# Altium schematic sheet Klon.SchDoc: BLACK - KC 1.0
size A3; Organization: Andrés Nomberto; Address1: facebook.com/; Address2: andres.nomberto; DocumentNumber: 1; Revision: 1.0; SheetNumber: 1; SheetTotal: 1; RepoGIT: https://github.com/AndresNomberto/KlonCentaur
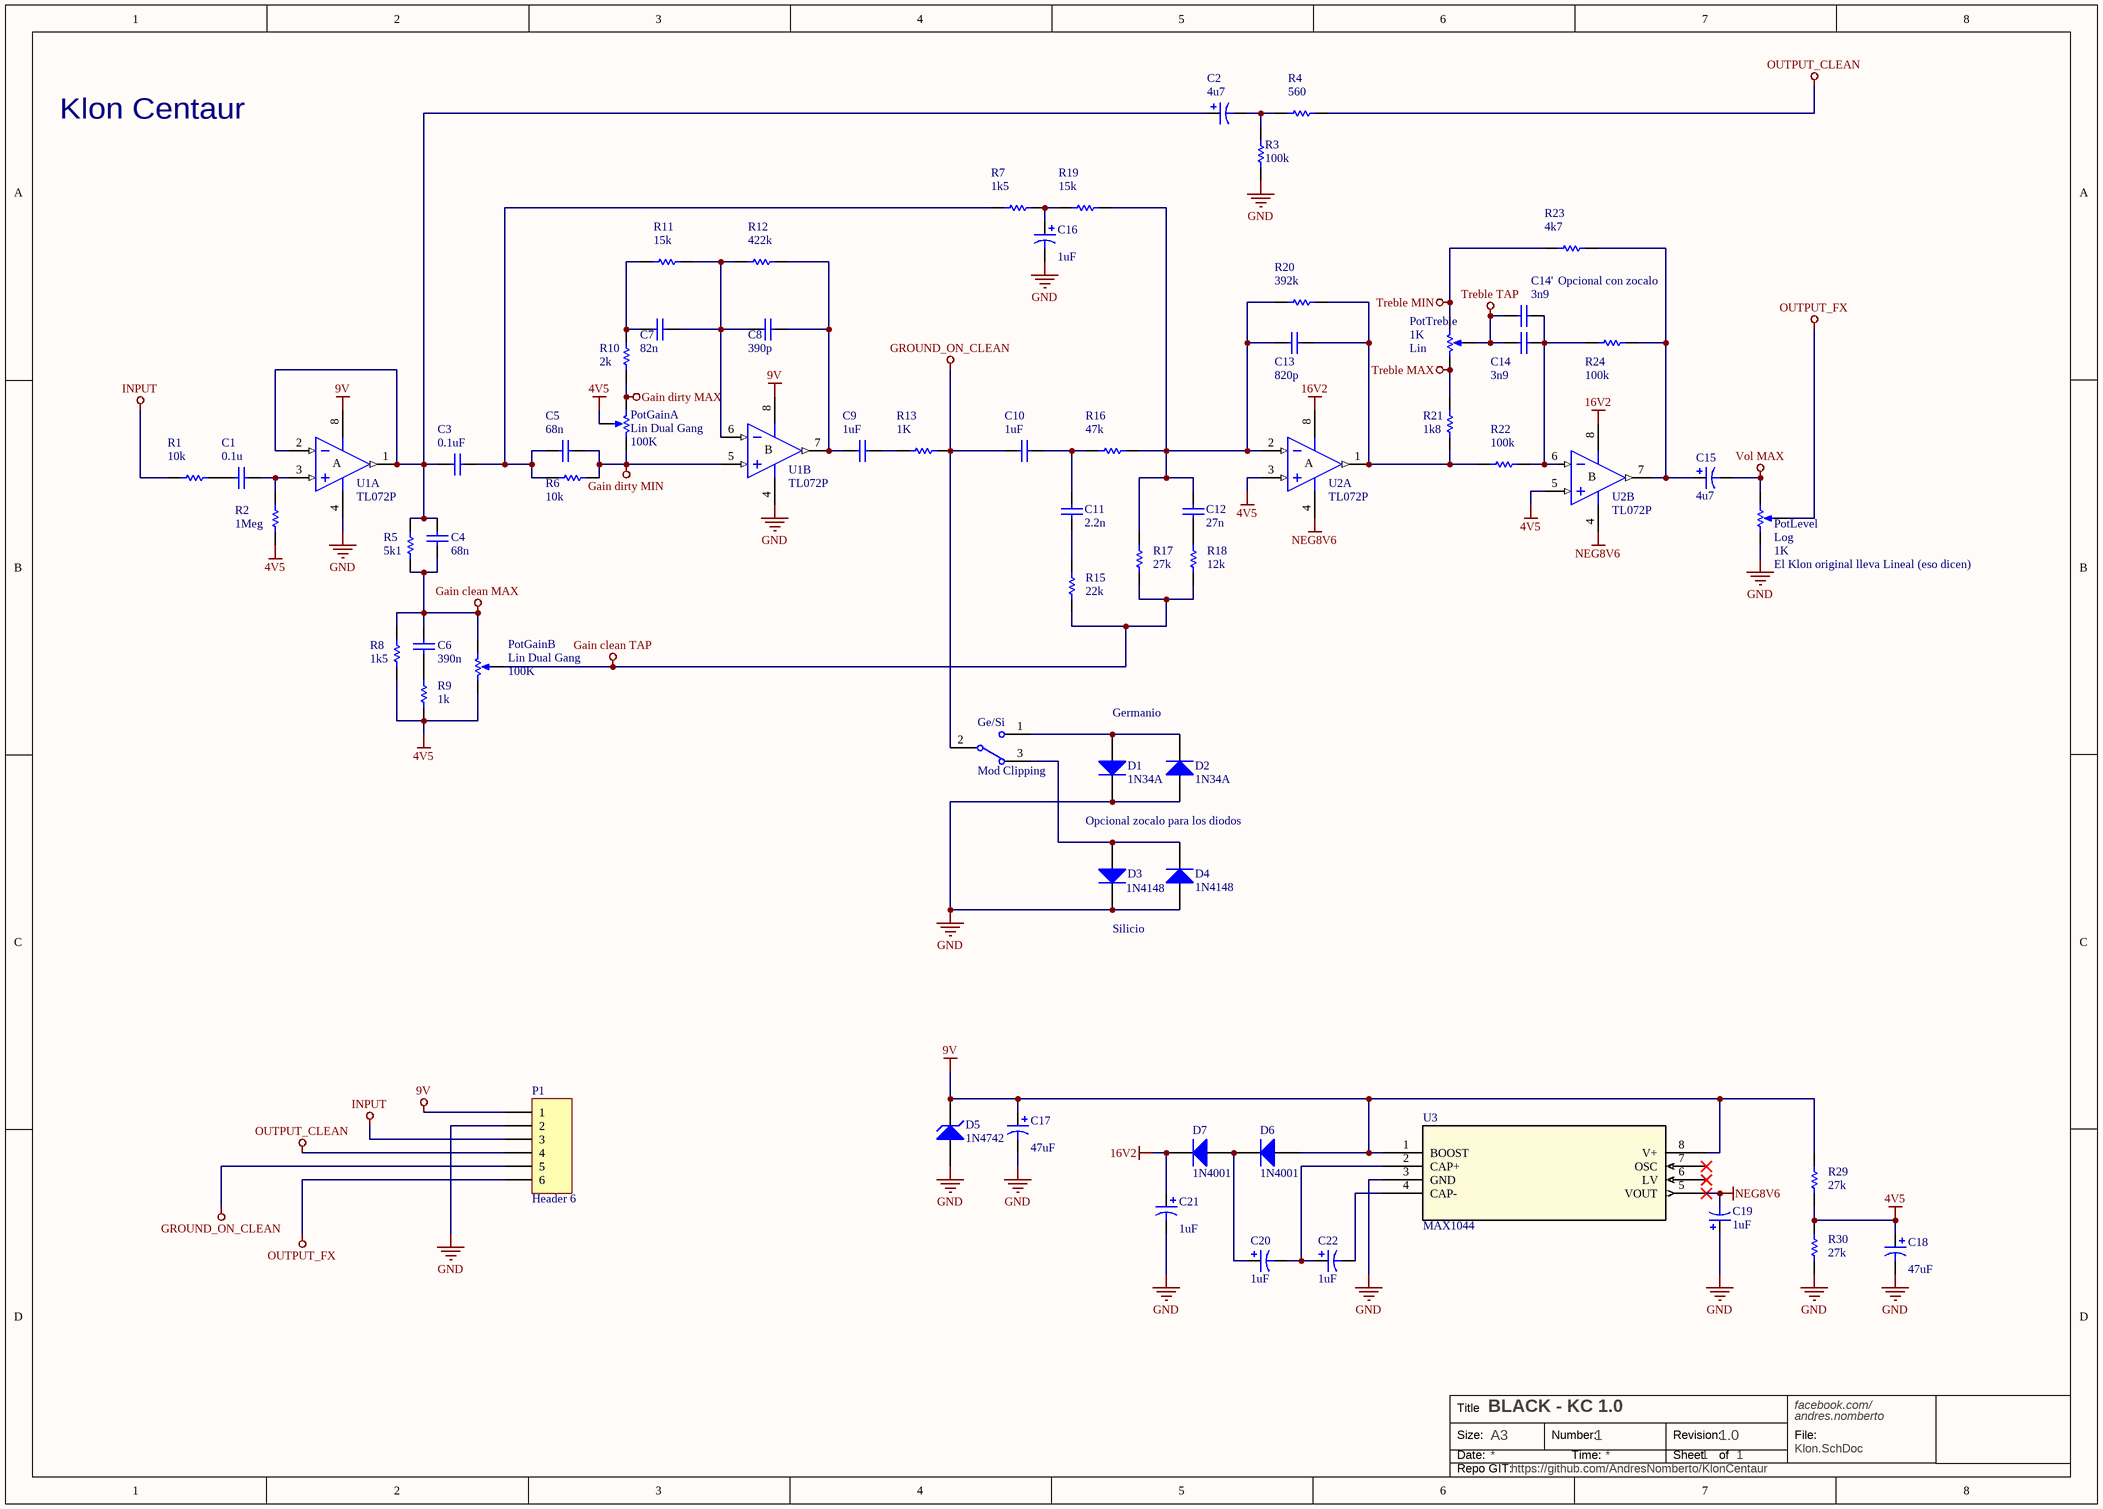
[diagram p0: Klon.SchDoc]

## Parts
C1  value 0.1u  [Cap Box 0.2]  (hidden comment: Cap)
C2  value 4u7  [Cap Pol 80mil]  (hidden comment: Cap Pol1)
C3  value 0.1uF  [Cap Box 0.2]  (hidden comment: Cap)
C4  value 68n  [Cap Box 0.2]  (hidden comment: Cap)
C5  value 68n  [Cap Box 0.2]  (hidden comment: Cap)
C6  value 390n  [Cap Polyester 200mil]  (hidden comment: Cap)
C7  value 82n  [Cap Box 0.2]  (hidden comment: Cap)
C8  value 390p  [Cap Ceramic]  (hidden comment: Cap)
C9  value 1uF  [Cap Box 0.2 FAT H400Mil]  (hidden comment: Cap)
C10  value 1uF  [Cap Box 0.2 FAT H400Mil]  (hidden comment: Cap)
C11  value 2.2n  [Cap Box 0.2]  (hidden comment: Cap)
C12  value 27n  [Cap Box 0.2]  (hidden comment: Cap)
C13  value 820p  [Cap Ceramic Multilayer]  (hidden comment: Cap)
C14  value 3n9  [Cap Box 0.2]  (hidden comment: Cap)
C14'  value 3n9  [Cap Box 0.2 Socket]  (hidden comment: Cap)
C15  value 4u7  [Cap Pol 80mil]  (hidden comment: Cap Pol1)
C16  value 1uF  [Cap Pol 60mil]  (hidden comment: Cap Pol1)
C17  value 47uF  [Cap Pol 100mil]  (hidden comment: Cap Pol1)
C18  value 47uF  [Cap Pol 100mil]  (hidden comment: Cap Pol1)
C19  value 1uF  [Cap Pol 60mil]  (hidden comment: Cap Pol1)
C20  value 1uF  [Cap Pol 60mil]  (hidden comment: Cap Pol1)
C21  value 1uF  [Cap Pol 60mil]  (hidden comment: Cap Pol1)
C22  value 1uF  [Cap Pol 60mil]  (hidden comment: Cap Pol1)
D1  1N34A  [DO35 Germanio]
D2  1N34A  [DO35 Germanio]
D3  1N4148  [DO35]
D4  1N4148  [DO35]
D5  1N4742  [DO41 Zener 250mils]
D6  1N4001  [DO41]
D7  1N4001  [DO41]
Ge/Si  Mod Clipping  [SWITCH SPDT 5mm]
P1  Header 6  [Header 6]
PotGain  Lin Dual Gang  value 100K  [POT DUAL]  (parts A,B of 2)
PotLevel  Log  value 1K  [POT]
PotTreble  Lin  value 1K  [POT]
R1  value 10k  [Res 0.2]  (hidden comment: Res1)
R2  value 1Meg  [Res 0.2]  (hidden comment: Res1)
R3  value 100k  [Res 0.2]  (hidden comment: Res1)
R4  value 560  [Res 0.2]  (hidden comment: Res1)
R5  value 5k1  [Res 0.2]  (hidden comment: Res1)
R6  value 10k  [Res 0.2]  (hidden comment: Res1)
R7  value 1k5  [Res 0.2]  (hidden comment: Res1)
R8  value 1k5  [Res 0.2]  (hidden comment: Res1)
R9  value 1k  [Res 0.2]  (hidden comment: Res1)
R10  value 2k  [Res 0.2]  (hidden comment: Res1)
R11  value 15k  [Res 0.2]  (hidden comment: Res1)
R12  value 422k  [Res 0.3]  (hidden comment: Res1)
R13  value 1K  [Res 0.2]  (hidden comment: Res1)
R15  value 22k  [Res 0.2]  (hidden comment: Res1)
R16  value 47k  [Res 0.2]  (hidden comment: Res1)
R17  value 27k  [Res 0.2]  (hidden comment: Res1)
R18  value 12k  [Res 0.2]  (hidden comment: Res1)
R19  value 15k  [Res 0.2]  (hidden comment: Res1)
R20  value 392k  [Res 0.3]  (hidden comment: Res1)
R21  value 1k8  [Res 0.2]  (hidden comment: Res1)
R22  value 100k  [Res 0.2]  (hidden comment: Res1)
R23  value 4k7  [Res 0.2]  (hidden comment: Res1)
R24  value 100k  [Res 0.2]  (hidden comment: Res1)
R29  value 27k  [Res 0.2]  (hidden comment: Res1)
R30  value 27k  [Res 0.2]  (hidden comment: Res1)
U1  TL072P  [DIP8]  (parts A,B of 2)
U2  TL072P  [DIP8]  (parts A,B of 2)
U3  MAX1044  [DIP8]

## Nets
4V5: C18.1 PotGain.2(TAP) PotGain.6(TOP) R2.1 R8.1 R9.1 R29.1 R30.2 U2.3(IN+) U2.5(IN+)
9V: C17.1 D5.2(K) D6.1(A) P1.1 R29.2 U1.8(V+) U3.1(BOOST) U3.8(V+)
16V2: C21.1 D7.2(K) U2.8(V+)
Gain clean MAX: C4.1 C6.2 PotGain.4(BOT) R5.1 R8.2
Gain clean TAP: PotGain.5(TAP) R15.1 R17.1 R18.1
Gain dirty MAX: PotGain.3(TOP) R10.1
Gain dirty MIN: C5.1 PotGain.1(BOT) R6.1 U1.5(IN+)
GND: C16.2 C17.2 C18.2 C19.1 C21.2 D1.2(K) D2.1(A) D3.2(K) D4.1(A) D5.1(A) P1.2 PotLevel.1(BOT) R3.1 R30.1 U1.4(V-) U3.3(GND)
GROUND_ON_CLEAN: C10.1 Ge/Si.2 P1.5 R13.2
INPUT: P1.3 R1.1
NEG8V6: C19.2 U2.4(V-) U3.5(VOUT)
OUTPUT_CLEAN: P1.4 R4.1
OUTPUT_FX: P1.6 PotLevel.2(TAP)
Treble MAX: PotTreble.3(TOP) R21.1
Treble MIN: PotTreble.1(BOT) R23.2
Treble TAP: C14.2 C14'.2 PotTreble.2(TAP)
Vol MAX: C15.2 PotLevel.3(TOP)
NetC1_1: C1.1 R1.2
NetC1_2: C1.2 R2.2 U1.3(IN+)
NetC2_1: C2.1 C3.1 C4.2 R5.2 U1.1(OUT) U1.2(IN-)
NetC2_2: C2.2 R3.2 R4.2
NetC3_2: C3.2 C5.2 R6.2 R7.1
NetC6_1: C6.1 R9.2
NetC7_1: C7.1 R10.2 R11.2
NetC7_2: C7.2 C8.1 R11.1 R12.2 U1.6(IN-)
NetC8_2: C8.2 C9.1 R12.1 U1.7(OUT)
NetC9_2: C9.2 R13.1
NetC10_2: C10.2 C11.1 R16.2
NetC11_2: C11.2 R15.2
NetC12_1: C12.1 R18.2
NetC12_2: C12.2 C13.2 R16.1 R17.2 R19.2 R20.2 U2.2(IN-)
NetC13_1: C13.1 R20.1 R21.2 R22.2 U2.1(OUT)
NetC14_1: C14.1 C14'.1 R22.1 R24.2 U2.6(IN-)
NetC15_1: C15.1 R23.1 R24.1 U2.7(OUT)
NetC16_1: C16.1 R7.2 R19.1
NetC20_1: C20.1 D6.2(K) D7.1(A)
NetC20_2: C20.2 C22.1 U3.2(CAP+)
NetC22_2: C22.2 U3.4(CAP-)
NetD1_1: D1.1(A) D2.2(K) Ge/Si.1
NetD3_1: D3.1(A) D4.2(K) Ge/Si.3

Not connected (* = marked no-connect by the designer): U3 6(LV)* 7(OSC)*

## Notes on the sheet
- Klon Centaur
- Opcional con zocalo
- (near PotLevel) El Klon original lleva Lineal (eso dicen)
- Germanio
- Opcional zocalo para los diodos
- Silicio
- Title
- Size:
- Date:
- A3
- Number:
- Time:
- Revision:
- Sheet
- of
- File:
- Repo GIT:
- (in symbol TL072P, part A) A
- (in symbol TL072P, part B) B

## Library data of the parts
C1 C3-C7 C9-C12 C14 C14' = Cap: Film Box; Published: 8-Jun-2000; LatestRevisionDate: 17-Jul-2002; LatestRevisionNote: Re-released for DXP Platform.; PackageReference: RAD-0.3; Publisher: Altium Limited; PackageDescription: Radial Cap, Thru-Hole; 2 Leads; 0.3 in Pin Spacing; ClassName: Klon
C2 C15-C22 = Cap Pol1: Electrolítico radial; Published: 8-Jun-2000; LatestRevisionDate: 17-Jul-2002; LatestRevisionNote: Re-released for DXP Platform.; PackageReference: RB7.6-15; Publisher: Altium Limited; PackageDescription: Polarized Capacitor (Radial); 2 Leads; ClassName: Klon
C8 C13 = Cap: Cerámico; Published: 8-Jun-2000; LatestRevisionDate: 17-Jul-2002; LatestRevisionNote: Re-released for DXP Platform.; PackageReference: RAD-0.3; Publisher: Altium Limited; PackageDescription: Radial Cap, Thru-Hole; 2 Leads; 0.3 in Pin Spacing; ClassName: Klon
D1 D2 = Diode 1N4148: Germanio; Published: 8-Jun-2000; LatestRevisionDate: 17-Jul-2002; LatestRevisionNote: Re-released for DXP Platform.; DatasheetVersion: 1997; PackageReference: DO-35; Publisher: Altium Limited; PackageDescription: Diode, Axial; Body 3.8 x 1.9 mm (LxDia. max), Lead Dia. 0.53 mm (max); Code_JEDEC: DO-204-AH; ComponentLink1Description: Manufacturer Link; ComponentLink1URL: http://www.fairchildsemi.com/; ComponentLink2Description: Datasheet; ComponentLink2URL: http://www.fairchildsemi.com/ds/1N%2F1N4148.pdf; ClassName: Klon; Parameter 1: *
D3 D4 = Diode 1N4148: Silicio, a gusto; Published: 8-Jun-2000; LatestRevisionDate: 17-Jul-2002; LatestRevisionNote: Re-released for DXP Platform.; DatasheetVersion: 1997; PackageReference: DO-35; Publisher: Altium Limited; PackageDescription: Diode, Axial; Body 3.8 x 1.9 mm (LxDia. max), Lead Dia. 0.53 mm (max); Code_JEDEC: DO-204-AH; ComponentLink1Description: Manufacturer Link; ComponentLink1URL: http://www.fairchildsemi.com/; ComponentLink2Description: Datasheet; ComponentLink2URL: http://www.fairchildsemi.com/ds/1N%2F1N4148.pdf; Parameter 1: *; ClassName: Klon
D5 = D Zener: Zener Diode; Published: 8-Jun-2000; LatestRevisionDate: 17-Jul-2002; LatestRevisionNote: Re-released for DXP Platform.; PackageReference: DIODE-0.7; Publisher: Altium Limited; PackageDescription: Diode, Thru-Hole; 2 Leads; 0.7 in Pin Spacing; ClassName: Klon
D6 D7 = Diode 1N4001: Diodo; Published: 8-Jun-2000; LatestRevisionDate: 17-Jul-2002; LatestRevisionNote: Re-released for DXP Platform.; DatasheetVersion: 1998; PackageVersion: Aug-1999; PackageReference: DO-41; Publisher: Altium Limited; PackageDescription: Diode, Axial; Body 5.2 x 2.7 mm (LxDia. max), Lead Dia. 0.86 mm (max); Code_JEDEC: DO-204-AL; ComponentLink1Description: Manufacturer Link; ComponentLink1URL: http://www.fairchildsemi.com/; ComponentLink2Description: Datasheet; ComponentLink2URL: http://www.fairchildsemi.com/ds/1N%2F1N4001.pdf; ClassName: Klon
Ge/Si = SW-SPDT: SPDT; Published: 24-Mar-1999; LatestRevisionDate: 17-Dec-2003; LatestRevisionNote: Schematic revised, PCB Footprint replaced.; DatasheetVersion: 05-Dec-2000; PackageReference: TL36WW15050; Publisher: Altium Limited; PackageDescription: Switch; 4 Leads; ComponentLink1Description: Manufacturer Link; ComponentLink1URL: http://www.apem.com
P1 = Header 6: Conector 6 pines; LatestRevisionDate: 17-Jul-2002; LatestRevisionNote: Re-released for DXP Platform.; Publisher: Altium Limited
PotGain = RPot Dual Gang: Pot Lineal doble; Sim Note: Enter the Resistance value and the set point into parameter fields.; Set Position: 0.5; Published: 8-Jun-2000; LatestRevisionDate: 17-Jul-2002; LatestRevisionNote: Re-released for DXP Platform.; PackageReference: VR5; Publisher: Altium Limited; PackageDescription: Variable Resistor, Thru-Hole; 3 Leads
PotLevel = RPot: Pot Logarítmico (el Klon original usa Lineal); Sim Note: Enter the Resistance value and the set point into parameter fields.; Set Position: 0.5; Published: 8-Jun-2000; LatestRevisionDate: 17-Jul-2002; LatestRevisionNote: Re-released for DXP Platform.; PackageReference: VR5; Publisher: Altium Limited; PackageDescription: Variable Resistor, Thru-Hole; 3 Leads
PotTreble = RPot: Pot Lineal; Sim Note: Enter the Resistance value and the set point into parameter fields.; Set Position: 0.5; Published: 8-Jun-2000; LatestRevisionDate: 17-Jul-2002; LatestRevisionNote: Re-released for DXP Platform.; PackageReference: VR5; Publisher: Altium Limited; PackageDescription: Variable Resistor, Thru-Hole; 3 Leads
R1-R11 R13 R15-R19 R21-R24 R29 R30 = Res1: Res 1/8; Published: 8-Jun-2000; LatestRevisionDate: 17-Jul-2002; LatestRevisionNote: Re-released for DXP Platform.; PackageReference: AXIAL-0.3; Publisher: Altium Limited; PackageDescription: Axial Device, Thru-Hole; 2 Leads; 0.3 in Pin Spacing; ClassName: Klon
R12 R20 = Res1: Res 1/8 o 1/4; Published: 8-Jun-2000; LatestRevisionDate: 17-Jul-2002; LatestRevisionNote: Re-released for DXP Platform.; PackageReference: AXIAL-0.3; Publisher: Altium Limited; PackageDescription: Axial Device, Thru-Hole; 2 Leads; 0.3 in Pin Spacing; ClassName: Klon
U1 U2 = TL072P: Low-Noise JFET-Input Operational Amplifier; Published: 16-Jan-2001; LatestRevisionDate: 04-Mar-2005; LatestRevisionNote: Stylized 3D Model Added.; DatasheetVersion: Aug-1996; PackageVersion: Jun-1999; PackageReference: P008; Publisher: Altium Limited; PackageDescription: DIP; 8 Leads; Row Spacing 7.62 mm; Pitch 2.54 mm; Code_JEDEC: MO-001-AN; ComponentLink1Description: Manufacturer Link; ComponentLink1URL: http://www.ti.com/; ComponentLink2Description: Datasheet; ComponentLink2URL: http://www-s.ti.com/sc/ds/tl072.pdf; ClassName: Klon
U3 = max1044epa+: No Description Available; Vendor: Maxim Integrated Products; Built_By: EMA_UL_Team; Manufacturer_Part_Number: max1044epa+; Copyright: Copyright (C) 2018 Accelerated Designs. All rights reserved; RefDes: RefDes; Type: DEV; Value: Value; ClassName: Klon